# Altium schematic sheet 15_Power.SchDoc: Power (part 2 of 2)
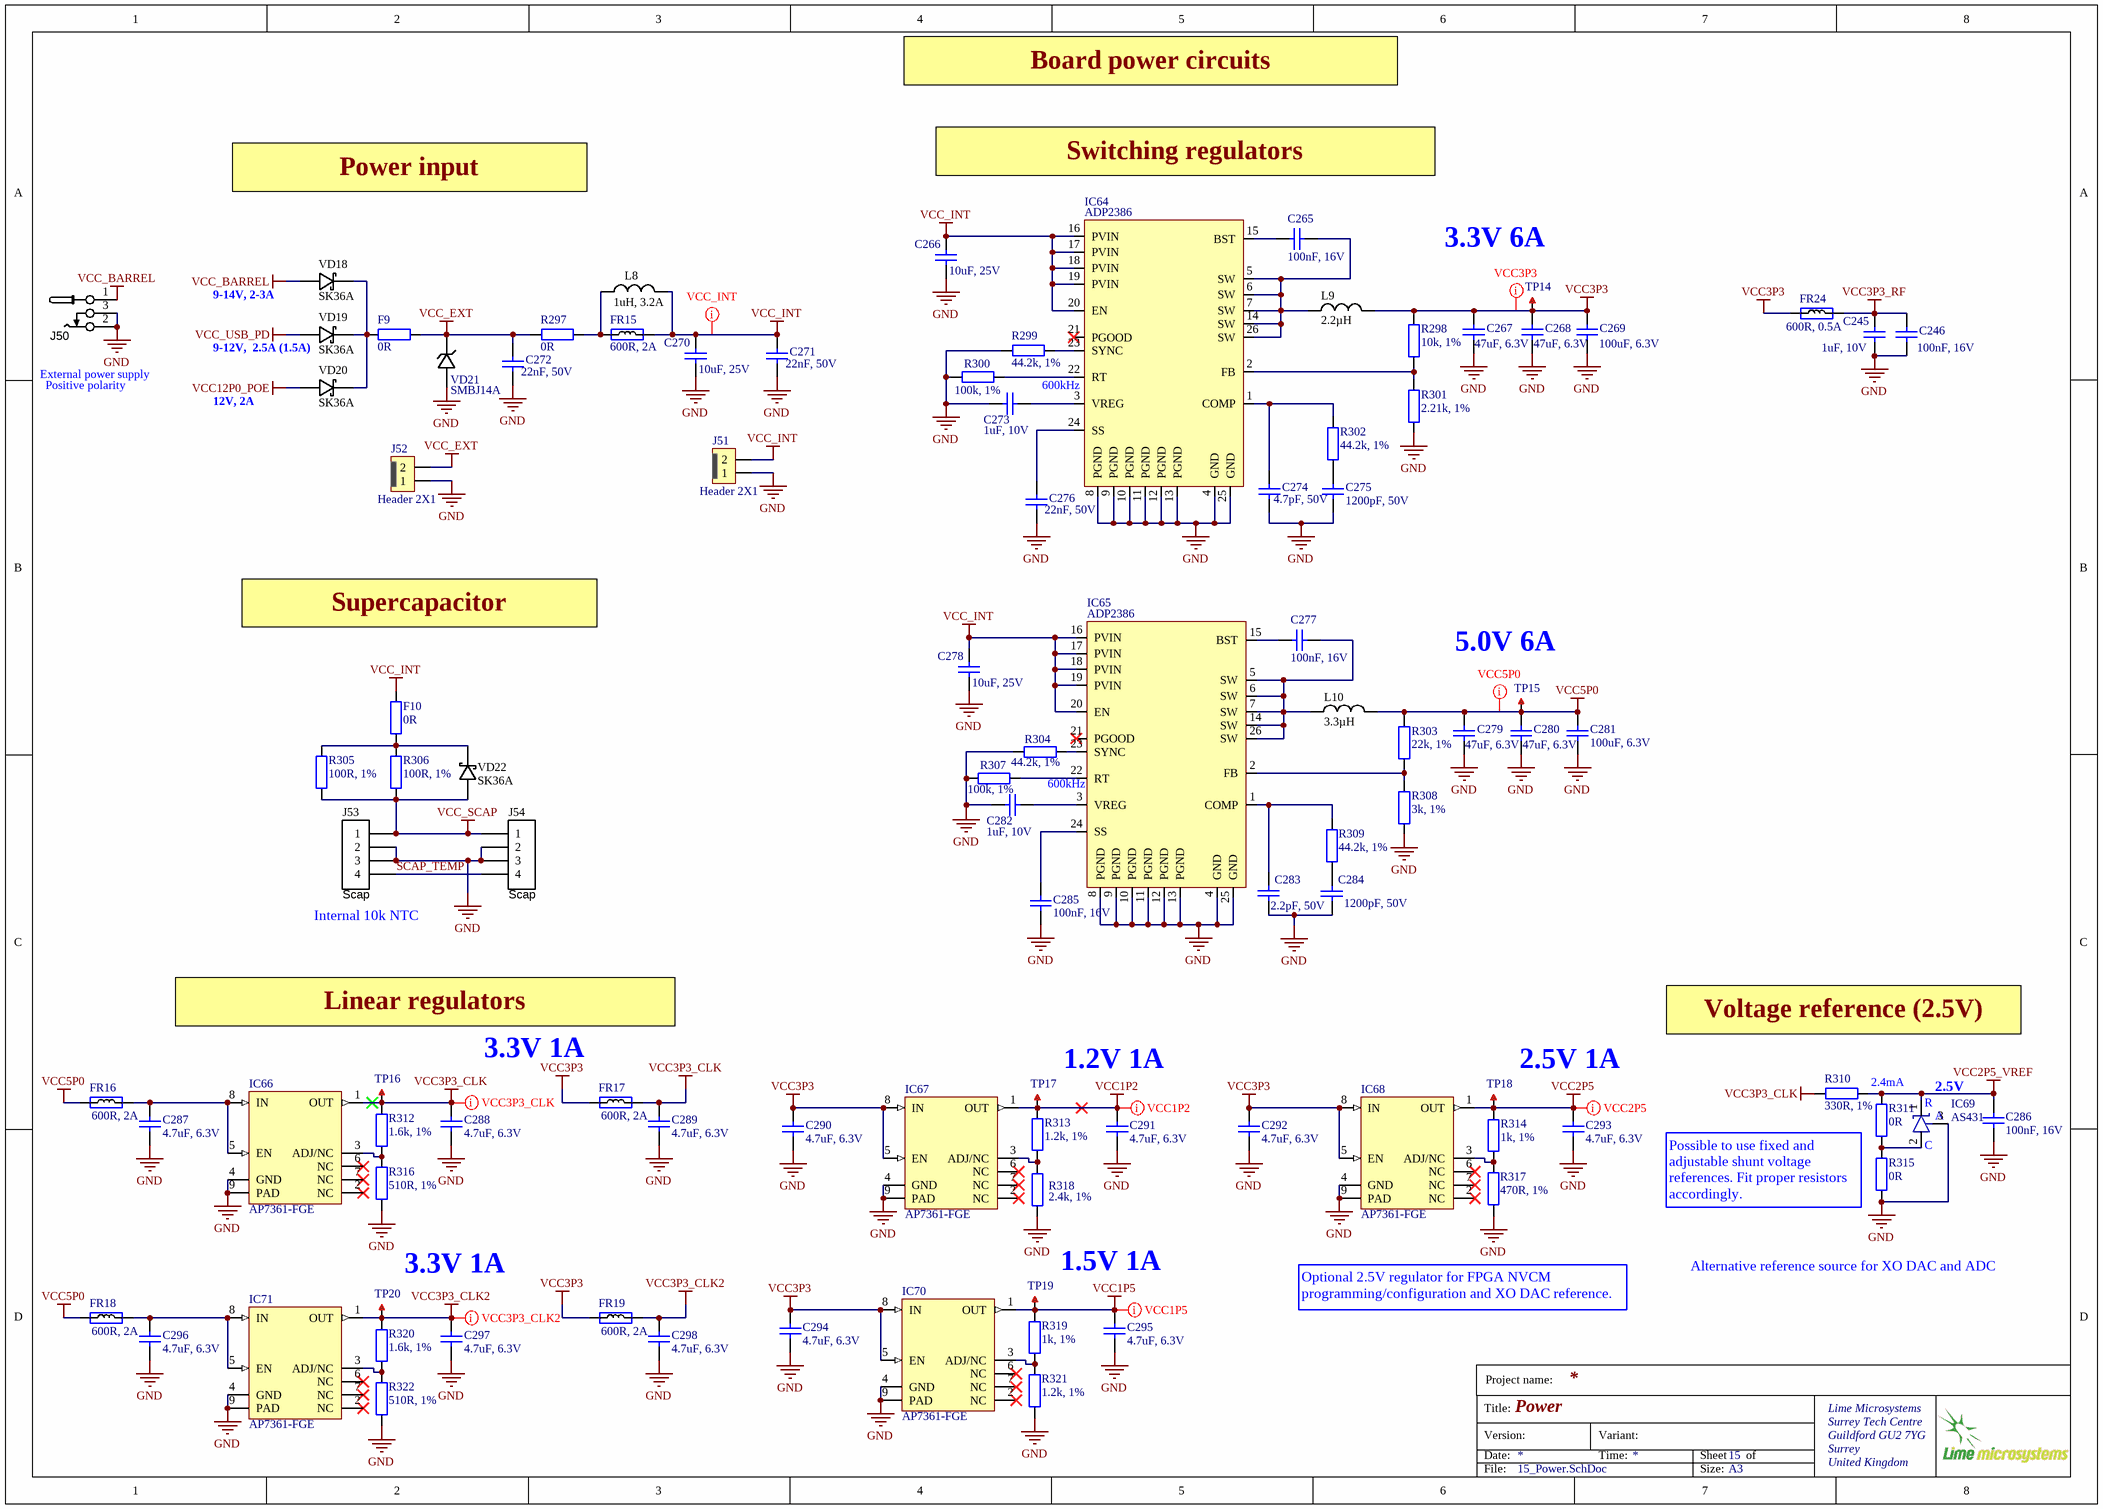
[diagram p1: 15_Power.SchDoc]

## Library data of the parts
C245 = Cap_0402: CAP CER 1UF 10V X5R 0402; Manufacturer: Yageo; Part Description: 1µF 10V Ceramic Capacitor X5R 0402 (1005 Metric) 0.039" L x 0.020" W (1.00mm x 0.50mm); Manufacturer Part Number 1: CC0402MRX5R6BB105; Notification: Current market demand for these product types have resulted in fluctuating and extending lead times. Lead times may differ.; Tolerance: ±20%; Value: 1uF, 10V; Supplier 1: Digi-Key; Supplier Part Number 1: 311-1732-1-ND; RoHS: RoHS Compliant; Applications: General Purpose; Category: Capacitors; ComponentLink1Description: http://www.yageo.com/documents/recent/UPY-GPHC_X5R_4V-to-50V_25.pdf; ComponentLink1URL: http://www.yageo.com/documents/recent/UPY-GPHC_X5R_4V-to-50V_25.pdf; Failure Rate: -; Features: -; Height - Seated (Max): -; Lead Spacing: -; Lead Style: -; Mounting Type: Surface Mount, MLCC; Operating Temperature: -55°C ~ 85°C; Package / Case: 0402 (1005 Metric); Packaging: Cut Tape (CT); Part Status: Active; Pricing 1: 1=0.22, 10=0.156, 100=0.0732, 500=0.0513, 1000=0.04248, 2500=0.03953, 5000=0.03617 (USD); Ratings: -; Size / Dimension: 0.039" L x 0.020" W (1.00mm x 0.50mm); Stock 1: 69600; Temperature Coefficient: X5R; Thickness (Max): 0.022" (0.55mm); Voltage - Rated: 10V
C246 = Cap_0603: Manufacturer Part Number 1: GRM155R71C104KA88D; Part Description: 0.10µF ±10% 16V Ceramic Capacitor X7R 0402 (1005 Metric); Brand: Murata Electronics; Tolerance: 10 %; Type: General Purpose MLCC; Capacitance: 0.1 uF; Temperature Coefficient / Code: +/- 15 %; Case Height: 0.5 mm; Case Length: 1 mm; Dielectric: X7R; Supplier 1: Mouser; Supplier Part Number 1: 81-GRM155R71C104KA88; Case Code - in: 0402; Manufacturer: Murata Electronics; Category: Multilayer Ceramic Capacitors MLCC - SMD/SMT; Voltage Rating DC: 16 V; Value: 100nF, 16V; Manufacturer Part Number: GRM155R71C104KA88D; Case Code - mm: 1005; Case Width: 0.5 mm; Maximum Operating Temperature: + 125 C; Minimum Operating Temperature: - 55 C; Minimum Order Quantity: 1; Operating Temperature Range: - 55 C to + 125 C; Package / Case: 0402 (1005 metric); Packaging: Reel; Product: General Type MLCCs; Product Category: Low & Medium Capacitance SMD Ceramic Chip Capacitors; Reeling: True; RoHS - Mouser: Y; RoHS: RoHS Compliant; Series: GRM; Standard Pack Qty: 10000; Termination Style: SMD/SMT
C265 C277 C285 = Cap_0402: Manufacturer: Murata Electronics; Manufacturer Part Number 1: GRM155R71C104KA88D; Part Description: 0.10µF ±10% 16V Ceramic Capacitor X7R 0402 (1005 Metric); Tolerance: 10 %; Type: General Purpose MLCC; Capacitance: 0.1 uF; Case Length: 1 mm; Dielectric: X7R; Case Height: 0.5 mm; Temperature Coefficient / Code: +/- 15 %; Value: 100nF, 16V; Supplier 1: Mouser; Supplier Part Number 1: 81-GRM155R71C104KA88; Case Code - in: 0402; RoHS: RoHS Compliant; Operating Temperature Range: - 55 C to + 125 C; Series: GRM; Termination Style: SMD/SMT; Package / Case: 0402 (1005 metric); Voltage Rating DC: 16 V; Maximum Operating Temperature: + 125 C; Case Code - mm: 1005; Minimum Operating Temperature: - 55 C; Product Category: Low & Medium Capacitance SMD Ceramic Chip Capacitors; Packaging: Reel; Product: General Type MLCCs; Category: Multilayer Ceramic Capacitors MLCC - SMD/SMT; Brand: Murata Electronics; Case Width: 0.5 mm; RoHS - Mouser: Y; Standard Pack Qty: 10000; Minimum Order Quantity: 1; Reeling: True; Manufacturer Part Number: GRM155R71C104KA88D
C266 C270 C278 = Cap_0603: Part Description: CAP CER 10UF 25V X5R 0805; Manufacturer: Murata; Manufacturer Part Number 1: GRM21BR61E106KA73K; Tolerance: 10%; Dielectric: X5R; value: 10uF, 25V; Supplier 1: Digi-Key; Supplier Part Number 1: 490-16824-1-ND; Stock 1: 781136; Pricing 1: 1=0,19, 10=0,13, 50=0,0778, 100=0,0656, 500=0,0449, 1000=0,03972, 2500=0,038, 5000=0,03454 (USD); RoHS: Yes; Mount: Surface Mount; Case/Package: 0805; Weight: 0.000335oz; Case Code (Imperial): 0805; Case Code (Metric): 2012; Min Operating Temperature: -55°C; Max Operating Temperature: 85°C; Packaging: Tape and Reel; Capacitance: 10uF; Voltage Rating: 25V; Package Quantity: 10000; Voltage Rating (DC): 25V; Series: GRM; Length: 0.079inch; Width: 0.049inch; Thickness: 0.055inch; RoHS Compliant: Yes; ComponentLink1URL: http://www.mouser.com/ds/2/281/c02e-2905.pdf?src-supplier=Mouser; ComponentLink1Description: http://www.mouser.com/ds/2/281/c02e-2905.pdf?src-supplier=Mouser; ComponentLink2URL: http://search.murata.co.jp/Ceramy/image/img/A01X/G101/ENG/GRM21BR61E106KA73-01.pdf?src-supplier=Digi-Key; ComponentLink2Description: http://search.murata.co.jp/Ceramy/image/img/A01X/G101/ENG/GRM21BR61E106KA73-01.pdf?src-supplier=Digi-Key; ComponentLink3URL: https://search.murata.co.jp/Ceramy/image/img/A01X/G101/ENG/GRM21BR61E106KA73-01.pdf?src-supplier=Digi-Key; ComponentLink3Description: https://search.murata.co.jp/Ceramy/image/img/A01X/G101/ENG/GRM21BR61E106KA73-01.pdf?src-supplier=Digi-Key
C267 C268 C279 C280 = Cap_1206: Manufacturer: Samsung Electro-Mechanics; Manufacturer Part Number: CL31A476MQHNNNE; Part Description: 47µF ±20% 6.3V Ceramic Capacitor X5R 1206 (3216 Metric); Notification: Current market demand for these product types have resulted in fluctuating and extending lead times. Lead times may differ.; Temperature Coefficient: X5R; Tolerance: ±20%; Thickness (Max): 0.071" (1.80mm); Height - Seated (Max): -; Operating Temperature: -55°C ~ 85°C; Lead Style: -; Package / Case: 1206 (3216 Metric); Size / Dimension: 0.126" L x 0.063" W (3.20mm x 1.60mm); Applications: General Purpose; Ratings: -; Mounting Type: Surface Mount, MLCC; Voltage - Rated: 6.3V; Lead Spacing: -; Features: -; Supplier Part Number 1: 1276-1167-1-ND; RoHS: RoHS Compliant; Category: Capacitors; Supplier 1: Digi-Key; Packaging: Cut Tape (CT); Part Status: Active; Value: 47uF, 6.3V; Manufacturer Part Number 1: CL31A476MQHNNNE
C269 C281 = Cap_1206: Manufacturer: MURATA; Manufacturer Part Number 1: GRM31CR60J107ME39L.; Part Description: SMD Multilayer Ceramic Capacitor, 1206 [3216 Metric], 100 µF, 6.3 V, ± 20%, X5R, GRM Series; Capacitance Tolerance: ± 20%; Ceramic Capacitor Case: 1206 [3216 Metric]; Voltage Rating: 6.3; value: 100uF, 6.3V; Supplier Part Number 1: 1735535; Supplier 1: Farnell
C271 C272 C276 = Cap_0402: Manufacturer: Kemet; Manufacturer Part Number 1: C0402C223K5RACTU; Part Description: 0.022µF ±10% 50V X7R Ceramic Capacitor -55°C ~ 125°C Surface Mount, MLCC 0402 (1005 Metric) 0.039" L x 0.020" W (1.00mm x 0.50mm); Temperature Coefficient: X7R; Tolerance: ±10%; Capacitance: 0.022µF; Value: 22nF, 50V; Supplier 1: Digi-Key; Supplier Part Number 1: 399-7780-1-ND; Ratings: -; Packaging: Cut Tape (CT); Category: Capacitors; Size / Dimension: 0.039" L x 0.020" W (1.00mm x 0.50mm); RoHS: RoHS Compliant; Operating Temperature: -55°C ~ 125°C; Mounting Type: Surface Mount, MLCC; Applications: General Purpose; Voltage - Rated: 50V; Thickness (Max): 0.022" (0.55mm); Features: -; Height - Seated (Max): -; Lead Style: -; Package / Case: 0402 (1005 Metric); Lead Spacing: -
C273 C282 = Cap_0402: Manufacturer Part Number 1: CC0402MRX5R6BB105; Manufacturer: Yageo; Part Description: 1µF 10V Ceramic Capacitor X5R 0402 (1005 Metric) 0.039" L x 0.020" W (1.00mm x 0.50mm); Voltage Rating: 10; Capacitance Tolerance: ± 10%; Product Range: TDK - C Series; Ceramic Capacitor Case: 0402 [1005 Metric]; Capacitance: 1; Dielectric Characteristic: X6; Value: 1uF, 10V; Supplier 1: Digi-Key; Supplier Part Number 1: 311-1732-1-ND; MSL: -; RoHS: YES
C274 = Cap_0402: Manufacturer Part Number 1: GRM1555C1H4R7CA01D; Part Description: 4.7pF ±0.25pF 50V C0G, NP0 Ceramic Capacitor -55°C ~ 125°C Surface Mount, MLCC 0402 (1005 Metric) 0.039" L x 0.020" W (1.00mm x 0.50mm); Manufacturer: Murata Electronics North America; Capacitance Tolerance: ± 0.25; Voltage Rating: 50; Dielectric Characteristic: C0G / NP0; Ceramic Capacitor Case: 0402 [1005 Metric]; Capacitance: 4.7; SVHC: No SVHC (15-Jun-2015; Product Range: GRM Series; Value: 4.7pF, 50V; Supplier 1: Farnell; Supplier Part Number 1: 2434644; Operating Temperature Max: 125; Operating Temperature Min: -55; MSL: MSL 1 - Unlimited; RoHS: YES; Packaging: Cut Tape
C275 = Cap_0402: Manufacturer: Kemet; Manufacturer Part Number 1: C0402C122J5GACTU; Part Description: 1200pF ±5% 50V C0G, NP0 Ceramic Capacitor -55°C ~ 125°C Surface Mount, MLCC 0402 (1005 Metric) 0.039" L x 0.020" W (1.00mm x 0.50mm); Temperature Coefficient: C0G, NP0; Tolerance: ±5%; Value: 1200pF, 50V; Supplier 1: Digi-Key; Supplier Part Number 1: 399-7334-1-ND; Thickness (Max): 0.022" (0.55mm); Capacitance: 1200pF; Lead Spacing: -; Mounting Type: Surface Mount, MLCC; Package / Case: 0402 (1005 Metric); Category: Capacitors; Size / Dimension: 0.039" L x 0.020" W (1.00mm x 0.50mm); Voltage - Rated: 50V; Lead Style: -; Ratings: -; Features: -; Packaging: Cut Tape (CT); RoHS: RoHS Compliant; Operating Temperature: -55°C ~ 125°C; Applications: General Purpose; Height - Seated (Max): -
C283 = Cap_0402: Manufacturer Part Number 1: CL05C2R2CB5NNNC; Manufacturer: Samsung Electro-Mechanics America, Inc.; Part Description: 2.2pF ±0.25pF 50V Ceramic Capacitor C0G, NP0 0402 (1005 Metric); Temperature Coefficient: C0G, NP0; Tolerance: ±0.25pF; Value: 2.2pF, 50V; Lead Spacing: -; Applications: General Purpose; Supplier 1: Digi-Key; Thickness (Max): 0.022" (0.55mm); Operating Temperature: -55°C ~ 125°C; Size / Dimension: 0.039" L x 0.020" W (1.00mm x 0.50mm); Mounting Type: Surface Mount, MLCC; Features: -; Voltage - Rated: 50V; Capacitance: 2.2pF; Lead Style: -; Supplier Part Number 1: 1276-1271-1-ND; Height - Seated (Max): -; Package / Case: 0402 (1005 Metric); Category: Capacitors; Packaging: Cut Tape (CT); Ratings: -; RoHS: RoHS Compliant
C284 = Cap_0402: Manufacturer: Kemet; Manufacturer Part Number 1: C0402C122J5GACTU; Part Description: 1200pF ±5% 50V Ceramic Capacitor C0G, NP0 0402 (1005 Metric); Temperature Coefficient: C0G, NP0; Tolerance: ±5%; Value: 1200pF, 50V; Supplier 1: Digi-Key; Supplier Part Number 1: 399-7334-1-ND; Thickness (Max): 0.022" (0.55mm); Capacitance: 1200pF; Lead Spacing: -; Mounting Type: Surface Mount, MLCC; Package / Case: 0402 (1005 Metric); Category: Capacitors; Size / Dimension: 0.039" L x 0.020" W (1.00mm x 0.50mm); Voltage - Rated: 50V; Lead Style: -; Ratings: -; Features: -; Packaging: Cut Tape (CT); RoHS: RoHS Compliant; Operating Temperature: -55°C ~ 125°C; Applications: General Purpose; Height - Seated (Max): -
C286 = Cap_0603: Manufacturer Part Number 1: GRM155R71C104KA88D; Part Description: 0.10µF ±10% 16V X7R Ceramic Capacitor -55°C ~ 125°C Surface Mount, MLCC 0402 (1005 Metric) 0.039" L x 0.020" W (1.00mm x 0.50mm); Brand: Murata Electronics; Tolerance: 10 %; Type: General Purpose MLCC; Capacitance: 0.1 uF; Temperature Coefficient / Code: +/- 15 %; Case Height: 0.5 mm; Case Length: 1 mm; Dielectric: X7R; Supplier 1: Mouser; Supplier Part Number 1: 81-GRM155R71C104KA88; Case Code - in: 0402; Manufacturer: Murata Electronics; Category: Multilayer Ceramic Capacitors MLCC - SMD/SMT; Voltage Rating DC: 16 V; Value: 100nF, 16V; Case Code - mm: 1005; Case Width: 0.5 mm; Maximum Operating Temperature: + 125 C; Minimum Operating Temperature: - 55 C; Minimum Order Quantity: 1; Operating Temperature Range: - 55 C to + 125 C; Package / Case: 0402 (1005 metric); Packaging: Reel; Product: General Type MLCCs; Product Category: Low & Medium Capacitance SMD Ceramic Chip Capacitors; Reeling: True; RoHS - Mouser: Y; RoHS: RoHS Compliant; Series: GRM; Standard Pack Qty: 10000; Termination Style: SMD/SMT
C287-C298 = Cap_0402: Manufacturer: Murata Electronics North America; Manufacturer Part Number 1: GRM155R60J475ME87D; Part Description: 4.7µF ±20% 6.3V X5R Ceramic Capacitor -55°C ~ 85°C Surface Mount, MLCC 0402 (1005 Metric) 0.039" L x 0.020" W (1.00mm x 0.50mm); Tolerance: ±20%; Capacitance: 4.7µF; Temperature Coefficient: X5R; Lead Style: -; Ratings: -; Height - Seated (Max): -; Thickness (Max): 0.022" (0.55mm); Voltage - Rated: 6.3V; Packaging: Cut Tape (CT); Lead Spacing: -; Category: Capacitors; Supplier Part Number 1: 490-5408-1-ND; Applications: General Purpose; Operating Temperature: -55°C ~ 85°C; Mounting Type: Surface Mount, MLCC; Features: Derating Recommended; RoHS: RoHS Compliant; Supplier 1: Digi-Key; Package / Case: 0402 (1005 Metric); Size / Dimension: 0.039" L x 0.020" W (1.00mm x 0.50mm); Value: 4.7uF, 6.3V
F9 F10 R297 = Res_0402: Manufacturer Part Number 1: CRCW08050000Z0EA; Manufacturer: Vishay Dale; Part Description: RES SMD 0.0 OHM JUMPER 1/8W 0805; Power (Watts): 0.125W, 1/8W; Resistance (Ohms): 0.0; Tolerance: Jumper; Value: 0R; Supplier 1: Digi-Key; Supplier Part Number 1: 541-0.0ATR-ND; Package / Case: 0805 (2012 Metric); Height: 0.020" (0.50mm); Packaging: Tape & Reel (TR); Operating Temperature: -55°C ~ 155°C; Temperature Coefficient: -; RoHS: RoHS Compliant; Size / Dimension: 0.079" L x 0.049" W (2.00mm x 1.25mm); Supplier Device Package: 0805 (2012 Metric); Number of Terminations: 2; Category: Resistors; Features: Automotive AEC-Q200; Composition: Thick Film
FR15 = Ferrite: Manufacturer Part Number 1: MPZ2012S601AT000; Manufacturer: TDK Corporation; Part Description: FERRITE BEAD 600 OHM 0805 1LN; DC Resistance (DCR): 100 mOhm Max; Filter Type: Differential Mode - Single; Impedance @ Frequency: 600 Ohm @ 100MHz; Supplier 1: Digi-Key; Supplier Part Number 1: 445-2206-2-ND; Value: 600R, 2A; Category: Filters; Current Rating: 2A; Height (Max): 0.041" (1.05mm); Mounting Type: Surface Mount; Package / Case: 0805 (2012 Metric); Packaging: Tape & Reel (TR); RoHS: RoHS Compliant; Size / Dimension: 0.079" L x 0.049" W (2.00mm x 1.25mm)
FR16-FR19 = Ferrite: Manufacturer Part Number 1: MPZ2012S601AT000; Manufacturer: TDK Corporation; Part Description: FERRITE BEAD 600 OHM 0805 1LN; Filter Type: Differential Mode - Single; Impedance @ Frequency: 600 Ohm @ 100MHz; DC Resistance (DCR): 100 mOhm Max; Supplier 1: Digi-Key; Supplier Part Number 1: 445-2206-2-ND; Mounting Type: Surface Mount; RoHS: RoHS Compliant; Height (Max): 0.041" (1.05mm); Packaging: Tape & Reel (TR); Category: Filters; Current Rating: 2A; Package / Case: 0805 (2012 Metric); Size / Dimension: 0.079" L x 0.049" W (2.00mm x 1.25mm)
FR24 = Ferrite: Manufacturer: Murata; Manufacturer Part Number 1: BLM15AX601SN1D; Part Description: - Ferrite Bead 0402 (1005 Metric) 500mA 340mOhm; Tolerance: 25%; Current Rating: 500mA; Number of Lines: 1; DC Resistance (DCR): 340mR; Test Frequency: 100MHz; Value: 600R, 0.5A; Supplier 1: Digi-Key; Supplier Part Number 1: 490-5441-1-ND; Stock 1: 416370; Pricing 1: 1=0.1, 10=0.06, 25=0.0552, 50=0.0496, 100=0.0363, 250=0.0264, 500=0.0242, 1000=0.0209, 5000=0.0165 (USD); Case/Package: 0402; Number of Pins: 2; Case Code (Metric): 1005; Case Code (Imperial): 0402; Core Material: Ferrite; Material: Steel,Ferrite; Min Operating Temperature: -55°C; Max Operating Temperature: 125°C; Package Quantity: 1; Packaging: Tape and Reel; Series: BLM15AX_SN; Impedance: 600R; Max Current Rating: 500mA; Termination: SMD/SMT; Max DC Current: 500mA; Number of Circuits: 1; DC Resistance-Max: 340mR; Length: 1mm; Width: 0.5mm; Height: 0.5mm; Depth: 0.5mm; REACH SVHC: No SVHC; Lead Free: Lead Free; RoHS Compliant: Yes; ComponentLink1URL: https://www.murata.com/en-us/products/productdata/8796740059166/ENFA0018.pdf?src-supplier=Digi-Key; ComponentLink1Description: https://www.murata.com/en-us/products/productdata/8796740059166/ENFA0018.pdf?src-supplier=Digi-Key; ComponentLink2URL: http://search.murata.co.jp/Ceramy/image/img/PDF/ENG/L0110S0100BLM15AX_SN.pdf?src-supplier=Future+Electronics; ComponentLink2Description: http://search.murata.co.jp/Ceramy/image/img/PDF/ENG/L0110S0100BLM15AX_SN.pdf?src-supplier=Future+Electronics; ComponentLink3URL: http://www.produktinfo.conrad.com/datenblaetter/1100000-1199999/001171675-da-01-en-CHIP_DROSSEL0402_600R_420MA_1_0X0_5MM.pdf?src-supplier=Conrad; ComponentLink3Description: http://www.produktinfo.conrad.com/datenblaetter/1100000-1199999/001171675-da-01-en-CHIP_DROSSEL0402_600R_420MA_1_0X0_5MM.pdf?src-supplier=Conrad; ComponentLink4URL: http://www.produktinfo.conrad.com/datenblaetter/1100000-1199999/001172169-da-01-en-DROSSEL_0402_600R_1_0X0_5MM_10000ST.pdf?src-supplier=Conrad; ComponentLink4Description: http://www.produktinfo.conrad.com/datenblaetter/1100000-1199999/001172169-da-01-en-DROSSEL_0402_600R_1_0X0_5MM_10000ST.pdf?src-supplier=Conrad
IC64 = ADP2386: Manufacturer Part Number: ADP2386ACPZN-R7; Manufacturer: Analog Devices Inc.; Part Description: IC REG BUCK ADJ 6A SYNC 24LFCSP; Function: Step-Down; Voltage - Output (Max): 18V; Synchronous Rectifier: Yes; Output Configuration: Positive; Frequency - Switching: 200kHz ~ 1.4MHz; Number of Outputs: 1; Output Type: Adjustable; Topology: Buck; Voltage - Input (Min): 4.5V; Voltage - Output (Min/Fixed): 0.6V; Voltage - Input (Max): 20V; Current - Output: 6A; Supplier 1: Digi-Key; Packaging: Digi-Reel®; RoHS: RoHS Compliant; Package / Case: 24-WFQFN Exposed Pad, CSP; Operating Temperature: -40°C ~ 125°C (TJ); Supplier Device Package 1: 24-LFCSP-WQ (4x4); Mounting Type: Surface Mount; Category: Integrated Circuits (ICs); Supplier Part Number 1: ADP2386ACPZN-R7DKR-ND; Manufacturer Part Number 1: ADP2386ACPZN-R7
IC65 = ADP2386: Manufacturer: Analog Devices Inc.; Part Description: Buck Switching Regulator IC Positive Adjustable 0.6V 1 Output 6A 24-WFQFN Exposed Pad, CSP; Manufacturer Part Number 1: ADP2386ACPZN-R7; Function: Step-Down; Voltage - Output (Max): 18V; Synchronous Rectifier: Yes; Output Configuration: Positive; Frequency - Switching: 200kHz ~ 1.4MHz; Number of Outputs: 1; Output Type: Adjustable; Topology: Buck; Voltage - Input (Min): 4.5V; Voltage - Output (Min/Fixed): 0.6V; Voltage - Input (Max): 20V; Current - Output: 6A; Supplier 1: Digi-Key; Packaging: Digi-Reel®; RoHS: RoHS Compliant; Package / Case: 24-WFQFN Exposed Pad, CSP; Operating Temperature: -40°C ~ 125°C (TJ); Supplier Device Package: 24-LFCSP-WQ (4x4); Mounting Type: Surface Mount; Category: Integrated Circuits (ICs); Supplier Part Number 1: ADP2386ACPZN-R7DKR-ND
IC66-IC68 IC70 IC71 = AP7361: Manufacturer Part Number 1: AP7361-FGE-7; Manufacturer: Diodes Incorporated; Part Description: IC REG LDO ADJ 1A 8DFN; Regulator Topology: Positive Adjustable; Current - Output: 1A; Current - Limit (Min): 1.1A; Voltage - Dropout (Typical): 0.5V @ 1A; Voltage - Output: 0.8 V ~ 5.5 V; Number of Regulators: 1; Voltage - Input: 2.2 V ~ 6 V; Supplier 1: Digi-Key; Supplier Part Number 1: AP7361-FGE-7DICT-ND; RoHS: RoHS Compliant; Supplier Device Package: U-DFN3030-8; Mounting Type: Surface Mount; Category: Integrated Circuits (ICs); Packaging: Cut Tape (CT); Package / Case: 8-UDFN Exposed Pad; Operating Temperature: -40°C ~ 85°C
IC69 = VOLTAGE_REFERENCE_UNIVERSAL: Manufacturer: Diodes; Manufacturer Part Number 1: AS431ANTR-G1; Part Description: Shunt Voltage Reference IC Adjustable 2.5V 36 VV ±0.5% 100 mA SOT-23-3; Cathode Current: 1mA; Max Input Voltage: 36V; Max Output Current: 100mA; Min Output Voltage: 2.5V; Output Type: Adjustable; Reference Type: Shunt; Temperature Coefficient: 20ppm/°C; Tolerance: 0.5%; ComponentLink1URL: https://datasheet.ciiva.com/1177/1643148-1177233.pdf?src-supplier=Avnet; ComponentLink1Description: https://datasheet.ciiva.com/1177/1643148-1177233.pdf?src-supplier=Avnet; Case/Package: TO-236-3; ComponentLink2Description: https://datasheet.ciiva.com/30002/as431-30002029.pdf?src-supplier=Avnet; ComponentLink2URL: https://datasheet.ciiva.com/30002/as431-30002029.pdf?src-supplier=Avnet; ComponentLink3Description: https://datasheet.ciiva.com/29572/as431-29572149.pdf?src-supplier=Digi-Key; ComponentLink3URL: https://datasheet.ciiva.com/29572/as431-29572149.pdf?src-supplier=Digi-Key; ComponentLink4Description: https://datasheet.ciiva.com/29572/as431-29572150.pdf?src-supplier=Digi-Key; ComponentLink4URL: https://datasheet.ciiva.com/29572/as431-29572150.pdf?src-supplier=Digi-Key; Max Operating Temperature: 125°C; Max Output Voltage: 36V; Min Operating Temperature: -40°C; Mount: Surface Mount; Number of Pins: 3; Output Current: 100mA; Output Voltage: 36V; Package Quantity: 3000; Packaging: Tape and Reel; Pricing 1: 1=0,36000, 10=0,27000, 25=0,23600, 100=0,15270, 250=0,12640, 500=0,10112, 1000=0,07753 (USD); Radiation Hardening: No; RoHS: Yes; RoHS Compliant: Yes; Stock 1: 792556; Supplier 1: Digi-Key; Supplier Part Number 1: AS431ANTR-G1DICT-ND
J50 = CONN_PWR_JACK_2.1x5.5mm: Power Connector, THT, 2.1mm ID, 5.5mm OD; Part Description: Power Barrel Connector Jack 2.00mm ID (0.079"), 5.50mm OD (0.217") Through Hole, Right Angle; Manufacturer: CUI Devices; Manufacturer Part Number 1: PJ002A; ComponentLink1URL: https://www.verical.com/server-webapp/html/getDatasheet?partID=110865; ComponentLink1Description: https://www.verical.com/server-webapp/html/getDatasheet?partID=110865; ComponentLink2URL: http://www.switchcraft.com/Documents/Jack_Schematics.pdf; ComponentLink2Description: http://www.switchcraft.com/Documents/Jack_Schematics.pdf; Supplier 1: Digikey; Supplier Part Number 1: CP-002A-ND; Stock 1: 22553; Pricing 1: 1=0.52, 10=0.442, 25=0.4144, 50=0.3948, 100=0.3758, 400=0.34075, 800=0.32448, 1200=0.31532, 2800=0.29702 (USD); RoHS: No; ComponentLink3URL: https://datasheet.octopart.com/PJ-002A-Same-Sky-datasheet-184403259.pdf?src-supplier=Future+Electronics; ComponentLink3Description: https://datasheet.octopart.com/PJ-002A-Same-Sky-datasheet-184403259.pdf?src-supplier=Future+Electronics; ComponentLink4URL: https://datasheet.octopart.com/PJ-002A-CUI-Devices-datasheet-175925523.pdf?src-supplier=Master+Electronics; ComponentLink4Description: https://datasheet.octopart.com/PJ-002A-CUI-Devices-datasheet-175925523.pdf?src-supplier=Master+Electronics
J51 J52 = Header 2X1 LOCK: Manufacturer 1: Molex; Part Description: Connector Header Through Hole 2 position 0.100" (2.54mm); Supplier 1: Digi-Key; Supplier Part Number 1: WM19460-ND; Manufacturer Part Number: 22-11-2026; Stock 1: 0; RoHS: Yes; ComponentLink1URL: https://datasheet.ciiva.com/5156/022045042-sd-206842-5156139.pdf?src-supplier=Mouser; ComponentLink1Description: https://datasheet.ciiva.com/5156/022045042-sd-206842-5156139.pdf?src-supplier=Mouser; ComponentLink2URL: https://datasheet.ciiva.com/30212/022232051-sd-30212109.pdf?src-supplier=Onlinecomponents.com; ComponentLink2Description: https://datasheet.ciiva.com/30212/022232051-sd-30212109.pdf?src-supplier=Onlinecomponents.com; Manufacturer: Molex; Manufacturer Part Number 1: 22-11-2026
J53 = Header4P: Header, 4-pin; Manufacturer 1: Molex; Manufacturer Part Number: 0874370443; Part Description: Connector Header Surface Mount 4 position 0.059" (1.50mm); ComponentLink1URL: http://katalog.we-online.de/em/datasheet/6130xx11121.pdf; ComponentLink1Description: http://katalog.we-online.de/em/datasheet/6130xx11121.pdf; Supplier 1: Digi-Key; Supplier Part Number 1: WM7664CT-ND; Stock 1: 30818; Pricing 1: 1=0,72000, 10=0,61200, 100=0,47560 (USD); RoHS: Yes; ComponentLink2URL: https://datasheet.ciiva.com/6813/874370443-sd-6813714.pdf?src-supplier=Digi-Key; ComponentLink2Description: https://datasheet.ciiva.com/6813/874370443-sd-6813714.pdf?src-supplier=Digi-Key; ComponentLink3URL: https://datasheet.ciiva.com/3935/197970874370443-pcb-headers-3935892.pdf?src-supplier=Arrow+Electronics; ComponentLink3Description: https://datasheet.ciiva.com/3935/197970874370443-pcb-headers-3935892.pdf?src-supplier=Arrow+Electronics; ComponentLink4URL: https://datasheet.ciiva.com/6813/874370443-sd-6813717.pdf?src-supplier=Digi-Key; ComponentLink4Description: https://datasheet.ciiva.com/6813/874370443-sd-6813717.pdf?src-supplier=Digi-Key; ComponentLink5URL: https://datasheet.ciiva.com/6813/874370443-sd-6813721.pdf?src-supplier=Digi-Key; ComponentLink5Description: https://datasheet.ciiva.com/6813/874370443-sd-6813721.pdf?src-supplier=Digi-Key; Manufacturer: Molex; Manufacturer Part Number 1: 0874370443
J54 = Header4P: Header, 4-pin; Part Description: 4 Positions Header Connector 0.100" (2.54mm) Through Hole Gold; Manufacturer: Wurth Electronics Inc.; Manufacturer Part Number 1: 61300411121; Pitch - Mating: 0.100" (2.54mm); Number of Positions: 4; Number of Positions Loaded: All; Style: Board to Board or Cable; Shrouding: Unshrouded; Contact Length - Mating: 0.236" (6.00mm); Contact Length - Post: 0.118" (3.00mm); Overall Contact Length: 0.454" (11.54mm); Material Flammability Rating: UL94 V-0; Current Rating: 3A; Voltage Rating: 250V; Supplier 1: Digi-Key; Supplier Part Number 1: 732-5317-ND; RoHS: RoHS Compliant; Category: Connectors, Interconnects; Stock 1: 25204; Pricing 1: 1=0.18, 10=0.153, 25=0.1272, 50=0.106, 100=0.096, 1000=0.088 (USD); Packaging: Bulk; Part Status: Active; Connector Type: Header; Contact Type: Male Pin; Number of Rows: 1; Row Spacing - Mating: -; Mounting Type: Through Hole; Termination: Solder; Fastening Type: Push-Pull; Insulation Height: 0.100" (2.54mm); Contact Shape: Square; Contact Finish - Mating: Gold; Contact Finish Thickness - Mating: -; Contact Finish - Post: -; Contact Material: Copper Alloy; Insulation Material: Polybutylene Terephthalate (PBT); Features: -; Operating Temperature: -40°C ~ 125°C; Ingress Protection: -; Insulation Color: Black; Mated Stacking Heights: -; Contact Finish Thickness - Post: -; Applications: -; ComponentLink1URL: http://katalog.we-online.de/em/datasheet/6130xx11121.pdf; ComponentLink1Description: http://katalog.we-online.de/em/datasheet/6130xx11121.pdf
L8 = Inductor_0603: Manufacturer: Taiyo Yuden; Manufacturer Part Number 1: NRS4018T1R0NDGJ; Part Description: 1 µH Shielded Drum Core, Wirewound Inductor 3.2 A 32.4mOhm Max Nonstandard; Core Material: Ferrite; Self Resonant Frequency: 90MHz; Tolerance: 30%; Saturation Current: 4A; Shielding: Shielded; DC Resistance (DCR): 32.4mR; Test Frequency: 100kHz; ComponentLink1URL: https://www.yuden.co.jp/productdata/catalog/en/wound04_e.pdf; ComponentLink1Description: https://www.yuden.co.jp/productdata/catalog/en/wound04_e.pdf; ComponentLink2URL: http://uk.rs-online.com/webdocs/10b3/0900766b810b3cd2.pdf; ComponentLink2Description: http://uk.rs-online.com/webdocs/10b3/0900766b810b3cd2.pdf; Supplier 1: Digi-Key; Supplier Part Number 1: 587-2888-1-ND; Stock 1: 277625; Pricing 1: 1=0,27000, 10=0,23800, 25=0,20840, 50=0,17860, 100=0,16370, 250=0,14884, 500=0,13990, 1000=0,10716 (USD); RoHS: Yes; Mount: Surface Mount; Case/Package: Nonstandard; Number of Pins: 2; Min Operating Temperature: -25°C; Max Operating Temperature: 125°C; Packaging: Cut Tape; Inductance: 1uH; Package Quantity: 3500; Current Rating: 3.2A; Inductance Tolerance: 30%; Resistor Type: Wirewound; Max DC Current: 4A; Termination: SMD/SMT; RMS Current (Irms): 3.2A; Series: NRS; Length: 4mm; Width: 0.157inch; Height: 1.8mm; Height - Seated (Max): 0.071inch; Depth: 4.2mm; Lead Pitch: 2.8mm; Radiation Hardening: No; Lead Free: Lead Free; Halogen Free: Halogen Free; REACH SVHC: Unknown; RoHS Compliant: Yes; ComponentLink3URL: https://datasheet.ciiva.com/1043/nrs4018t1r0ndgj-ss-1043587.pdf?src-supplier=Digi-Key; ComponentLink3Description: https://datasheet.ciiva.com/1043/nrs4018t1r0ndgj-ss-1043587.pdf?src-supplier=Digi-Key; ComponentLink4URL: https://datasheet.ciiva.com/25607/0900766b810b3cd2-25607942.pdf?src-supplier=RSComponents; ComponentLink4Description: https://datasheet.ciiva.com/25607/0900766b810b3cd2-25607942.pdf?src-supplier=RSComponents; ComponentLink5URL: https://datasheet.ciiva.com/8504/nrs4018t1r0ndgj-ss-8504305.pdf?src-supplier=Avnet; ComponentLink5Description: https://datasheet.ciiva.com/8504/nrs4018t1r0ndgj-ss-8504305.pdf?src-supplier=Avnet; Value: 1uH, 3.2A
L9 = Inductor_0603: Manufacturer Part Number 1: IHLP4040DZER2R2M01; Manufacturer: Vishay Dale; Part Description: 2.2µH Shielded Molded Inductor 12A 9 mOhm Max Nonstandard; Type: Molded; Current Rating: 12A; Frequency - Test: 100kHz; Current - Saturation: 25.6A; DC Resistance (DCR): 9 mOhm Max; Shielding: Shielded; Tolerance: ±20%; Supplier 1: Digi-Key; Supplier Part Number 1: 541-1299-1-ND; Package / Case: Nonstandard; Material - Core: -; Size / Dimension: 0.430" L x 0.405" W (10.92mm x 10.30mm); Supplier Device Package: -; Inductance: 2.2µH; Frequency - Self Resonant: -; Packaging: Cut Tape (CT); Height - Seated (Max): 0.158" (4.00mm); Category: Inductors, Coils, Chokes; RoHS: RoHS Compliant; Mounting Type: Surface Mount; Operating Temperature: -55°C ~ 125°C; Q @ Freq: -; value: 2.2µH
L10 = Inductor_0603: Manufacturer: Vishay Dale; Manufacturer Part Number 1: IHLP4040DZER3R3M01; Part Description: 3.3µH Shielded Molded Inductor 10A 14.4 mOhm Max Nonstandard; DC Resistance (DCR): 14.4 mOhm Max; Shielding: Shielded; Type: Molded; Current Rating: 10A; Frequency - Test: 100kHz; Current - Saturation: 18.6A; Tolerance: ±20%; value: 3.3µH; Package / Case: Nonstandard; Q @ Freq: -; Supplier 1: Digi-Key; Packaging: Cut Tape (CT); Inductance: 3.3µH; Material - Core: -; Category: Inductors, Coils, Chokes; Frequency - Self Resonant: -; Height - Seated (Max): 0.158" (4.00mm); Supplier Device Package: -; RoHS: RoHS Compliant; Size / Dimension: 0.430" L x 0.405" W (10.92mm x 10.30mm); Mounting Type: Surface Mount; Operating Temperature: -55°C ~ 125°C; Supplier Part Number 1: 541-1298-1-ND
R298 = Res_0402: Manufacturer: Yageo; Manufacturer Part Number 1: RC0402FR-0710KL; Part Description: RES SMD 10K OHM 1% 1/16W 0402; Temperature Coefficient: ±100ppm/°C; Power (Watts): 0.063W, 1/16W; Value: 10k, 1%; Supplier 1: Digi-Key; Supplier Part Number 1: 311-10.0KLRTR-ND; Resistance (Ohms): 10k; Packaging: Tape & Reel (TR); RoHS: RoHS Compliant; Package / Case: 0402 (1005 Metric); Tolerance: ±1%; Operating Temperature: -55°C ~ 155°C; Size / Dimension: 0.039" L x 0.020" W (1.00mm x 0.50mm); Number of Terminations: 2; Category: Resistors; Height: 0.016" (0.40mm); Supplier Device Package: 0402; Features: Moisture Resistant; Composition: Thick Film
R299 R302 R304 R309 = Res_0402: Manufacturer Part Number 1: ERJ-2RKF4422X; Manufacturer: Panasonic Electronic Components; Part Description: RES SMD 44.2K OHM 1% 1/10W 0402; Power (Watts): 0.1W, 1/10W; Temperature Coefficient: ±100ppm/°C; Value: 44.2k, 1%; Supplier 1: Digi-Key; Supplier Part Number 1: P44.2KLCT-ND; Tolerance: ±1%; Supplier Device Package: 0402; Packaging: Cut Tape (CT); Size / Dimension: 0.039" L x 0.020" W (1.00mm x 0.50mm); Features: Automotive AEC-Q200; Package / Case: 0402 (1005 Metric); Height: 0.016" (0.40mm); Operating Temperature: -55°C ~ 155°C; Number of Terminations: 2; Composition: Thick Film; Resistance (Ohms): 44.2k; RoHS: RoHS Compliant; Category: Resistors
R300 R307 = Res_0402: Part Description: 100 kOhms ±1% 0.063W, 1/16W Chip Resistor 0402 (1005 Metric) Thick Film; Manufacturer: Vishay; Manufacturer Part Number 1: CRCW0402100KFKEDC; Power Rating: 62.5mW; Resistance: 100kR; Temperature Coefficient: 100ppm/°C; Value: 100k, 1%; Supplier 1: Digi-Key; Supplier Part Number 1: 541-3960-6-ND; Stock 1: 702107; Pricing 1: 1=0,10000, 10=0,03300, 100=0,01360, 1000=0,00610, 2500=0,00529, 5000=0,00437 (USD); RoHS: Yes; Mount: Surface Mount; Case/Package: SMD/SMT; Contact Plating: Tin; Min Operating Temperature: -55°C; Max Operating Temperature: 155°C; Tolerance: 1%; Resistor Type: Thick Film; Termination: Wraparound; Length: 1mm; Lead Free: Lead Free; RoHS Compliant: Yes; ComponentLink1URL: http://www.vishay.com/docs/28773/crcwce3.pdf?src-supplier=Digi-Key; ComponentLink1Description: http://www.vishay.com/docs/28773/crcwce3.pdf?src-supplier=Digi-Key
R301 = Res_0402: Manufacturer: Stackpole Electronics Inc.; Manufacturer Part Number 1: RMCF0402FT2K21; Part Description: RES SMD 2.21K OHM 1% 1/16W 0402; Power (Watts): 0.063W, 1/16W; Temperature Coefficient: ±100ppm/°C; Value: 2.21k, 1%; Supplier 1: Digi-Key; Supplier Part Number 1: RMCF0402FT2K21CT-ND; Operating Temperature: -55°C ~ 155°C; Height: 0.016" (0.40mm); Tolerance: ±1%; Resistance (Ohms): 2.21k; Features: Automotive AEC-Q200; Package / Case: 0402 (1005 Metric); Packaging: Cut Tape (CT); Composition: Thick Film; Category: Resistors; Supplier Device Package: 0402; Number of Terminations: 2; RoHS: RoHS Compliant; Size / Dimension: 0.039" L x 0.020" W (1.00mm x 0.50mm)
R303 = Res_0402: Manufacturer: Yageo; Part Description: RES SMD 22K OHM 1% 1/16W 0402; Manufacturer Part Number 1: RC0402FR-0722KL; Temperature Coefficient: ±100ppm/°C; Power (Watts): 0.063W, 1/16W; Value: 22k, 1%; Number of Terminations: 2; Operating Temperature: -55°C ~ 155°C; Package / Case: 0402 (1005 Metric); Category: Resistors; Size / Dimension: 0.039" L x 0.020" W (1.00mm x 0.50mm); Height: 0.016" (0.40mm); Supplier 1: Digi-Key; Supplier Part Number 1: 311-22.0KLRCT-ND; RoHS: RoHS Compliant; Features: Moisture Resistant; Packaging: Cut Tape (CT); Composition: Thick Film; Supplier Device Package: 0402; Resistance (Ohms): 22k; Tolerance: ±1%
R305 R306 = Res_0402: Manufacturer: Yageo; Manufacturer Part Number 1: RC0805FR-07100RL; Part Description: 100 Ohms ±1% 0.125W, 1/8W Chip Resistor 0805 (2012 Metric) Moisture Resistant Thick Film; Power Rating: 125mW; Voltage Rating: 150V; Temperature Coefficient: 100ppm/°C; Application(s): HIGH RELIABILITY; Value: 100R, 1%; Supplier 1: Digi-Key; Supplier Part Number 1: 311-100CRCT-ND; Stock 1: 3385227; Pricing 1: 1=0,10000, 10=0,03800, 100=0,01560, 1000=0,00699, 2500=0,00607 (USD); RoHS: Yes; Case/Package: 0805; Number of Pins: 2; Case Code (Imperial): 0805; Case Code (Metric): 2012; Weight: 0.000917oz; Min Operating Temperature: -55°C; Max Operating Temperature: 155°C; Resistance: 100R; Tolerance: 1%; Packaging: Cut Tape; Package Quantity: 5000; Termination: SMD/SMT; Resistor Type: Thick Film; Number of Terminations: 2; Max Power Dissipation: 125mW; Features: Moisture Resistant; Series: RC; Technology: THICK FILM; Voltage Rating (DC): 150V; Type: General Purpose; Length: 2mm; Width: 1.25mm; Height: 0.5mm; Depth: 1.25mm; Lead Pitch: 0.4mm; REACH SVHC: Unknown; Lead Free: Lead Free; RoHS Compliant: Yes; Military Standard: Not
R308 = Res_0402: Manufacturer: Vishay Dale; Part Description: RES SMD 3K OHM 1% 1/16W 0402; Manufacturer Part Number 1: CRCW04023K00FKED; Temperature Coefficient: ±100ppm/°C; Power (Watts): 0.063W, 1/16W; Value: 3k, 1%; Category: Resistors; Tolerance: ±1%; RoHS: RoHS Compliant; Composition: Thick Film; Number of Terminations: 2; Operating Temperature: -55°C ~ 155°C; Supplier Device Package: 0402 (1005 Metric); Supplier Part Number 1: 541-3.00KLCT-ND; Packaging: Cut Tape (CT); Supplier 1: Digi-Key; Package / Case: 0402 (1005 Metric); Features: Automotive AEC-Q200; Resistance (Ohms): 3k; Height: 0.016" (0.40mm); Size / Dimension: 0.039" L x 0.020" W (1.00mm x 0.50mm)
R310 = Res_0402: Manufacturer: Yageo; Manufacturer Part Number 1: RC0402FR-07330RL; Part Description: 330 Ohms ±1% 0.063W, 1/16W Chip Resistor 0402 (1005 Metric) Moisture Resistant Thick Film; Temperature Coefficient: 100ppm/°C; Max Power Dissipation: 63mW; Power Rating: 62.5mW; Voltage Rating: 50V; Value: 330R, 1%; Supplier 1: Digi-Key; Supplier Part Number 1: 311-330LRCT-ND; Height: 0.016inch; Number of Terminations: 2; Packaging: Tape and Reel; Tolerance: 1%; Features: Moisture Resistant; RoHS: Yes; Case/Package: 0402; Case Code (Imperial): 0402; Case Code (Metric): 1005; ComponentLink1Description: http://www.farnell.com/datasheets/2167052.pdf?src-supplier=Farnell; ComponentLink1URL: http://www.farnell.com/datasheets/2167052.pdf?src-supplier=Farnell; ComponentLink2Description: http://www.farnell.com/datasheets/2167052.pdf?src-supplier=Newark; ComponentLink2URL: http://www.farnell.com/datasheets/2167052.pdf?src-supplier=Newark; ComponentLink3Description: http://www.farnell.com/datasheets/1018594.pdf?src-supplier=Element14; ComponentLink3URL: http://www.farnell.com/datasheets/1018594.pdf?src-supplier=Element14; Construction: Rectangular; Depth: 0.5mm; Lead Free: Lead Free; Length: 0.039inch; Max Operating Temperature: 155°C; Military Standard: Not; Min Operating Temperature: -55°C; Package Quantity: 1; Pricing 1: 1=0,10000, 10=0,01500, 100=0,00610, 1000=0,00275, 2500=0,00239, 5000=0,00197 (USD); REACH SVHC: Unknown; Resistance: 330R; Resistance Tolerance: 1%; Resistor Type: Thick Film; RoHS Compliant: Yes; Series: RC; Size Code: 0402; Stock 1: 7298585; Technology: THICK FILM; Termination: SMD/SMT; Width: 0.02inch
R311 R315 = Res_0402: Manufacturer Part Number 1: RC0402JR-070RL; Manufacturer: Yageo; Part Description: RES SMD 0.0OHM JUMPER 1/16W 0402; Resistance (Ohms): 0.0; Tolerance: Jumper; Power (Watts): 0.063W, 1/16W; Value: 0R; Supplier 1: Digi-Key; Supplier Part Number 1: 311-0.0JRTR-ND; Category: Resistors; Temperature Coefficient: -; Features: Moisture Resistant; Supplier Device Package: 0402; Height: 0.016" (0.40mm); Package / Case: 0402 (1005 Metric); Operating Temperature: -55°C ~ 155°C; Size / Dimension: 0.039" L x 0.020" W (1.00mm x 0.50mm); Composition: Thick Film; Packaging: Tape & Reel (TR); Number of Terminations: 2; RoHS: RoHS Compliant
R312 R320 = Res_0402: Manufacturer Part Number 1: RC0402FR-071K6L; Manufacturer: Yageo; Part Description: 1.6 kOhms ±1% 0.063W, 1/16W Chip Resistor 0402 (1005 Metric) Moisture Resistant Thick Film; Temperature Coefficient: ±100ppm/°C; Power (Watts): 0.063W, 1/16W; Value: 1.6k, 1%; Tolerance: ±1%; RoHS: RoHS Compliant; Package / Case: 0402 (1005 Metric); Height - Seated (Max): 0.016" (0.40mm); Supplier Device Package: 0402; Failure Rate: -; Composition: Thick Film; Part Status: Active; Size / Dimension: 0.039" L x 0.020" W (1.00mm x 0.50mm); Operating Temperature: -55°C ~ 155°C; Packaging: Cut Tape (CT); Features: Moisture Resistant; Supplier Part Number 1: YAG3045CT-ND; Category: Resistors; Supplier 1: Digi-Key
R313 R321 = Res_0402: Manufacturer Part Number 1: RC0402FR-071K2L; Part Description: 1.2 kOhms ±1% 0.063W, 1/16W Chip Resistor 0402 (1005 Metric) Moisture Resistant Thick Film; Manufacturer: Yageo; Resistance: 1.2kR; Power Rating: 63mW; Voltage Rating: 50V; Temperature Coefficient: 100ppm/°C; Value: 1.2k, 1%; Supplier 1: Digi-Key; Supplier Part Number 1: 311-1.20KLRCT-ND; Stock 1: 1348237; Pricing 1: 1=0,10000, 10=0,01500, 100=0,00610, 1000=0,00275, 2500=0,00239, 5000=0,00197 (USD); RoHS: Yes; Case/Package: 0402; Case Code (Imperial): 0402; Case Code (Metric): 1005; Size Code: 0402; Min Operating Temperature: -55°C; Max Operating Temperature: 155°C; Tolerance: 1%; Packaging: Tape and Reel; Package Quantity: 1; Termination: SMD/SMT; Resistor Type: Thick Film; Number of Terminations: 2; Max Power Dissipation: 63mW; Features: Moisture Resistant; Series: RC; Construction: Rectangular; Resistance Tolerance: 1%; Technology: THICK FILM; Length: 1mm; Width: 0.02inch; Height: 0.016inch; Depth: 0.5mm; REACH SVHC: Unknown; Military Standard: Not; Lead Free: Lead Free; RoHS Compliant: Yes; ComponentLink1URL: https://datasheet.ciiva.com/11808/0900766b80c66297-11808455.pdf?src-supplier=RSComponents; ComponentLink1Description: https://datasheet.ciiva.com/11808/0900766b80c66297-11808455.pdf?src-supplier=RSComponents; ComponentLink2URL: https://datasheet.ciiva.com/2453/pyu-r-int-thick-7-2453467.pdf?src-supplier=Digi-Key; ComponentLink2Description: https://datasheet.ciiva.com/2453/pyu-r-int-thick-7-2453467.pdf?src-supplier=Digi-Key; ComponentLink3URL: https://datasheet.ciiva.com/2453/pyu-r-int-thick-7-2453468.pdf?src-supplier=Digi-Key; ComponentLink3Description: https://datasheet.ciiva.com/2453/pyu-r-int-thick-7-2453468.pdf?src-supplier=Digi-Key; ComponentLink4URL: https://datasheet.ciiva.com/2453/pyu-r-int-thick-7-2453466.pdf?src-supplier=Digi-Key; ComponentLink4Description: https://datasheet.ciiva.com/2453/pyu-r-int-thick-7-2453466.pdf?src-supplier=Digi-Key; ComponentLink5URL: https://datasheet.ciiva.com/7849/1018594-7849861.pdf?src-supplier=Element14; ComponentLink5Description: https://datasheet.ciiva.com/7849/1018594-7849861.pdf?src-supplier=Element14; ComponentLink6URL: https://datasheet.ciiva.com/7849/1018594-7849862.pdf?src-supplier=Element14; ComponentLink6Description: https://datasheet.ciiva.com/7849/1018594-7849862.pdf?src-supplier=Element14; ComponentLink7URL: https://datasheet.ciiva.com/15189/getdatasheetpartid-323716-15189366.pdf?src-supplier=Verical; ComponentLink7Description: https://datasheet.ciiva.com/15189/getdatasheetpartid-323716-15189366.pdf?src-supplier=Verical; ComponentLink8URL: https://datasheet.ciiva.com/16745/pyu-rc0402-51-rohs-l-6-r-16745005.pdf?src-supplier=Future+Electronics; ComponentLink8Description: https://datasheet.ciiva.com/16745/pyu-rc0402-51-rohs-l-6-r-16745005.pdf?src-supplier=Future+Electronics
R314 R319 = Res_0402: Manufacturer: Stackpole Electronics Inc; Manufacturer Part Number 1: RMCF0402FT1K00; Part Description: RES SMD 1K OHM 1% 1/16W 0402; Temperature Coefficient: ±100ppm/°C; Power (Watts): 0.063W, 1/16W; Value: 1k, 1%; Supplier 1: Digi-Key; Supplier Part Number 1: RMCF0402FT1K00TR-ND; Resistance (Ohms): 1k; Packaging: Tape & Reel (TR); Category: Resistors; RoHS: RoHS Compliant; Tolerance: ±1%; Height: 0.016" (0.40mm); Number of Terminations: 2; Package / Case: 0402 (1005 Metric); Operating Temperature: -55°C ~ 155°C; Features: -; Composition: Thick Film; Supplier Device Package: 0402; Size / Dimension: 0.039" L x 0.020" W (1.00mm x 0.50mm)
R316 R322 = Res_0402: Manufacturer Part Number 1: RC0402FR-07510RL; Manufacturer: Yageo; Part Description: 510 Ohms ±1% 0.063W, 1/16W Chip Resistor 0402 (1005 Metric) Moisture Resistant Thick Film; Temperature Coefficient: ±100ppm/°C; Power (Watts): 0.063W, 1/16W; Value: 510R, 1%; Operating Temperature: -55°C ~ 155°C; Part Status: Active; Tolerance: ±1%; Packaging: Cut Tape (CT); Features: Moisture Resistant; Composition: Thick Film; Supplier Device Package: 0402; Failure Rate: -; Package / Case: 0402 (1005 Metric); Height - Seated (Max): 0.016" (0.40mm); Size / Dimension: 0.039" L x 0.020" W (1.00mm x 0.50mm); Supplier 1: Digi-Key; RoHS: RoHS Compliant; Category: Resistors; Supplier Part Number 1: 311-510LRCT-ND
R317 = Res_0402: Manufacturer: Yageo; Manufacturer Part Number 1: RC0402FR-07470RL; Part Description: 470 Ohms ±1% 0.063W, 1/16W Chip Resistor 0402 (1005 Metric) Moisture Resistant Thick Film; Power Rating: 62.5mW; Temperature Coefficient: 100ppm/°C; Voltage Rating: 50V; Max Power Dissipation: 63mW; Value: 470R, 1%; Supplier 1: Digi-Key; Supplier Part Number 1: 311-470LRCT-ND; Stock 1: 1652476; Pricing 1: 1=0,10000, 10=0,01600, 100=0,00660, 1000=0,00299, 2500=0,00259, 5000=0,00214 (USD); RoHS: Yes; Case/Package: 0402; Case Code (Metric): 1005; Case Code (Imperial): 0402; Size Code: 0402; Min Operating Temperature: -55°C; Max Operating Temperature: 155°C; Packaging: Tape and Reel; Tolerance: 1%; Resistance: 470R; Number of Terminations: 2; Features: Moisture Resistant; Package Quantity: 1; Resistor Type: Thick Film; Termination: SMD/SMT; Series: RC; Resistance Tolerance: 1%; Construction: Rectangular; Length: 1mm; Width: 0.02inch; Height: 0.016inch; Depth: 0.5mm; Lead Free: Lead Free; REACH SVHC: Unknown; Military Standard: Not; RoHS Compliant: Yes
R318 = Res_0402: Manufacturer Part Number 1: RC0402FR-072K4L; Manufacturer: Yageo; Part Description: 2.4 kOhms ±1% 0.063W, 1/16W Chip Resistor 0402 (1005 Metric) Moisture Resistant Thick Film; Temperature Coefficient: ±100ppm/°C; Power (Watts): 0.063W, 1/16W; Value: 2.4k, 1%; Package / Case: 0402 (1005 Metric); RoHS: RoHS Compliant; Supplier Part Number 1: 311-2.40KLRCT-ND; Resistance (Ohms): 2.4k; Size / Dimension: 0.039" L x 0.020" W (1.00mm x 0.50mm); Category: Resistors; Part Status: Active; Features: Moisture Resistant; Supplier Device Package: 0402; Failure Rate: -; Tolerance: ±1%; Composition: Thick Film; Packaging: Cut Tape (CT); Operating Temperature: -55°C ~ 155°C; Height - Seated (Max): 0.016" (0.40mm); Supplier 1: Digi-Key
TP14-TP20 = TESTPOINT_PAD: Test Point PCB mount Miniature White
VD18-VD20 VD22 = DIODE_SCHOTTKY_SOD-523F: Diode Schottky SMD SOD-523F; Manufacturer Part Number 1: SK36A-LTP; Manufacturer: Micro Commercial Co; Part Description: DIODE SCHOTTKY 60V 3A DO214AC; Current - Reverse Leakage @ Vr: 500µA @ 60V; Speed: Fast Recovery =< 500ns, > 200mA (Io); Voltage - DC Reverse (Vr) (Max): 60V; Capacitance @ Vr, F: 250pF @ 4V, 1MHz; Voltage - Forward (Vf) (Max) @ If: 750mV @ 3A; Current - Average Rectified (Io): 3A; Supplier 1: Digi-Key; Supplier Part Number 1: SK36A-LTPMSCT-ND; Package / Case: DO-214AC, SMA; Reverse Recovery Time (trr): -; Diode Type: Schottky; Category: Discrete Semiconductor Products; Mounting Type: Surface Mount; RoHS: RoHS Compliant; Packaging: Cut Tape (CT); Operating Temperature - Junction: -50°C ~ 125°C; Supplier Device Package: DO-214AC (SMA)
VD21 = DIODE_TVS_UNIDIR: SMAJ12CA-13-F; Manufacturer: Taiwan Semiconductor; Part Description: 23.2V Clamp 25.9A Ipp Tvs Diode Surface Mount DO-214AA (SMB); Operating Supply Voltage: 14V; Max Surge Current: 100A; Breakdown Voltage: 15.6V; Number of Channels: 1; Clamping Voltage: 23.2V; Peak Pulse Power: 600W; Polarity: Unidirectional; ComponentLink1URL: http://www.farnell.com/datasheets/2358777.pdf?src-supplier=Farnell; ComponentLink1Description: http://www.farnell.com/datasheets/2358777.pdf?src-supplier=Farnell; ComponentLink2URL: http://www.mouser.com/ds/2/395/SMBJ%20SERIES-231843.pdf?src-supplier=Mouser; ComponentLink2Description: http://www.mouser.com/ds/2/395/SMBJ%20SERIES-231843.pdf?src-supplier=Mouser; ComponentLink3URL: http://www.farnell.com/datasheets/2358777.pdf?src-supplier=Element14; ComponentLink3Description: http://www.farnell.com/datasheets/2358777.pdf?src-supplier=Element14; Supplier 1: Digi-Key; Supplier Part Number 1: SMBJ14AFSCT-ND; Manufacturer Part Number 1: SMBJ14A; Stock 1: 17494; Pricing 1: 1=0,54000, 10=0,46400, 100=0,34630, 500=0,27212, 1000=0,21028 (USD); RoHS: Yes; Case/Package: DO-214AA; Number of Pins: 2; Min Operating Temperature: -65°C; Max Operating Temperature: 150°C; Packaging: Tape and Reel; Package Quantity: 3000; Voltage Rating (DC): 14V; Power Rating: 600W; Length: 5.59mm; Width: 3.94mm; Height: 2.44mm; Lead Free: Lead Free; RoHS Compliant: Yes; Value: SMBJ14A